# Altium schematic sheet vias.SchDoc
size A
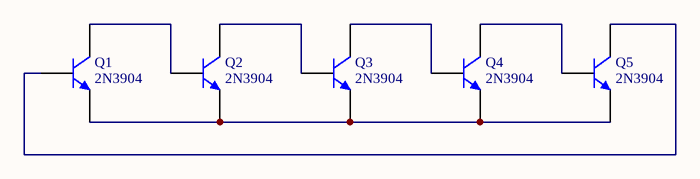
[diagram p0: vias.SchDoc]

## Parts
Q1  2N3904  [TO-92A]
Q2  2N3904  [TO-92A]
Q3  2N3904  [TO-92A]
Q4  2N3904  [TO-92A]
Q5  2N3904  [TO-92A]

## Nets
NetQ1_1: Q1.1(E) Q2.1(E) Q3.1(E) Q4.1(E) Q5.1(E)
NetQ1_2: Q1.2(B) Q5.3(C)
NetQ1_3: Q1.3(C) Q2.2(B)
NetQ2_3: Q2.3(C) Q3.2(B)
NetQ3_3: Q3.3(C) Q4.2(B)
NetQ4_3: Q4.3(C) Q5.2(B)

## Library data of the parts
Q1-Q5 = 2N3904: NPN General Purpose Amplifier; Published: 8-Jun-2000; LatestRevisionDate: 15-Jan-2003; LatestRevisionNote: PCB Footprint 'BCY-W3/D4.7' replaced; DatasheetVersion: 1997; PackageVersion: Sep-1998; PackageReference: TO-92A; Publisher: Altium Limited; PackageDescription: TO, Flat Index; 3 In-Line, Axial Leads; Body Dia. 4.5mm; Leads 0.51 x 0.48 mm (max); ComponentLink1Description: Manufacturer Link; ComponentLink1URL: http://www.fairchildsemi.com/; ComponentLink2Description: Datasheet; ComponentLink2URL: http://www.fairchildsemi.com/ds/2N%2F2N3904.pdf